# Altium schematic sheet 04 Glove Sensors.SchDoc
size 355 x 304 mm
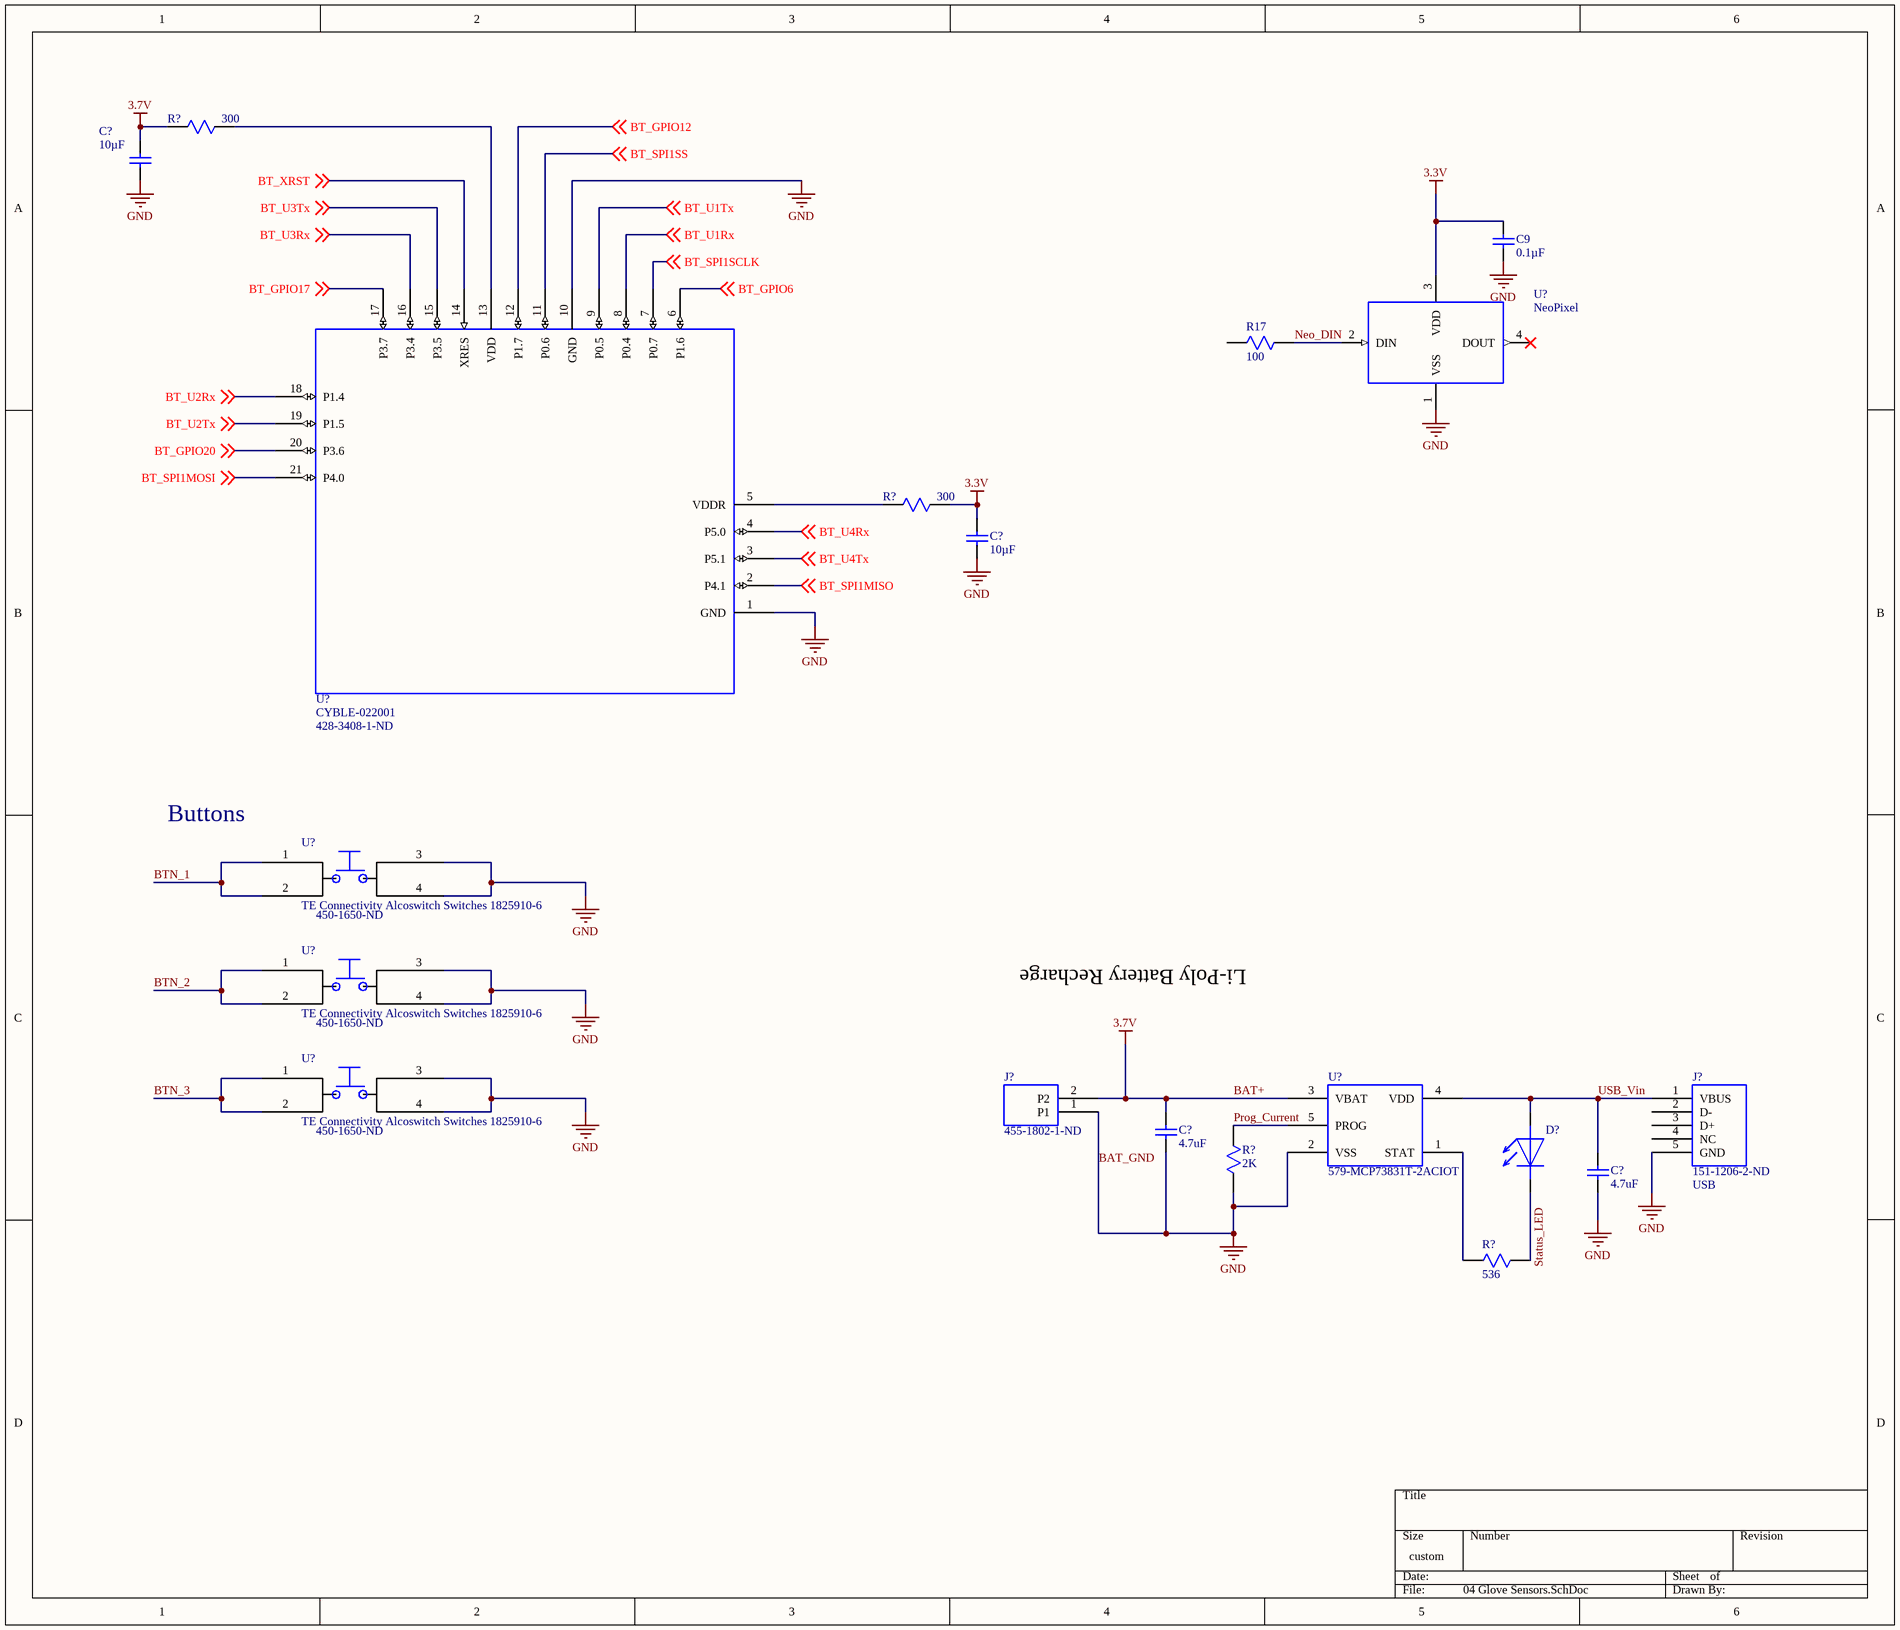
[diagram p0: 04 Glove Sensors.SchDoc]

## Parts
(Parts that share a designator on the sheet are numbered #1, #2 ... from top to bottom, then left to right.)
C9  value 0.1µF  [CAP_0805]  (hidden comment: CAP_0805_U_000_10)
C?#1  value 10µF  [CAP_0805]  (hidden comment: CAP_0805_U_010_00)
C?#2  value 10µF  [CAP_0805]  (hidden comment: CAP_0805_U_010_00)
C?#3  value 4.7uF  (hidden comment: CAP_4.7_uF)
C?#4  value 4.7uF  (hidden comment: CAP_4.7_uF)
D?  LNJ115W88RA  (value not drawn)
J?#1  Supplier Part Number 1: 455-1802-1-ND  (hidden comment: 455-1802-2-ND)
J?#2  value USB  (hidden comment: 151-1206-2-ND)
R17  value 100  [RES_0805]  (hidden comment: RES_0805_R_100_00)
R?#1  value 300  (hidden comment: RC0402JR-07300RL)
R?#2  value 300  (hidden comment: RC0402JR-07300RL)
R?#3  value 2K  (hidden comment: RMCF2010JT2K00)
R?#4  value 536  (hidden comment: ERJ-12SF5360U)
U?#1  NeoPixel  [WS2812B]
U?#2  TE Connectivity Alcoswitch Switches 1825910-6  Supplier Part Number 1: 450-1650-ND
U?#3  value CYBLE-022001  Supplier Part Number 1: 428-3408-1-ND  (hidden comment: CYBLE-022001-00)
U?#4  TE Connectivity Alcoswitch Switches 1825910-6  Supplier Part Number 1: 450-1650-ND
U?#5  TE Connectivity Alcoswitch Switches 1825910-6  Supplier Part Number 1: 450-1650-ND
U?#6  Supplier Part Number 1: 579-MCP73831T-2ACIOT  (hidden comment: MCP73831)

## Nets
3.3V: C9.2 C?#2.2 R?#2.2 U?#1.3(VDD)
BAT+: C?#1.2 C?#3.2 J?#1.2(P2) R?#1.1 U?#6.3(VBAT)  [also labelled 3.7V]
BAT_GND: C9.1 C?#1.1 C?#2.1 C?#3.1 C?#4.1 J?#1.1(P1) J?#2.5(GND) R?#3.2 U?#1.1(VSS) U?#2.3 U?#2.4 U?#3.1(GND) U?#3.10(GND) U?#4.3 U?#4.4 U?#5.3 U?#5.4 U?#6.2(VSS)  [also labelled GND]
BT_GPIO6: U?#3.6(P1.6) ; off-sheet BT_GPIO6
BT_GPIO12: U?#3.12(P1.7) ; off-sheet BT_GPIO12
BT_GPIO17: U?#3.17(P3.7) ; off-sheet BT_GPIO17
BT_GPIO20: U?#3.20(P3.6) ; off-sheet BT_GPIO20
BT_SPI1MISO: U?#3.2(P4.1) ; off-sheet BT_SPI1MISO
BT_SPI1MOSI: U?#3.21(P4.0) ; off-sheet BT_SPI1MOSI
BT_SPI1SCLK: U?#3.7(P0.7) ; off-sheet BT_SPI1SCLK
BT_SPI1SS: U?#3.11(P0.6) ; off-sheet BT_SPI1SS
BT_U1Rx: U?#3.8(P0.4) ; off-sheet BT_U1Rx
BT_U1Tx: U?#3.9(P0.5) ; off-sheet BT_U1Tx
BT_U2Rx: U?#3.18(P1.4) ; off-sheet BT_U2Rx
BT_U2Tx: U?#3.19(P1.5) ; off-sheet BT_U2Tx
BT_U3Rx: U?#3.16(P3.4) ; off-sheet BT_U3Rx
BT_U3Tx: U?#3.15(P3.5) ; off-sheet BT_U3Tx
BT_U4Rx: U?#3.4(P5.0) ; off-sheet BT_U4Rx
BT_U4Tx: U?#3.3(P5.1) ; off-sheet BT_U4Tx
BT_XRST: U?#3.14(XRES) ; off-sheet BT_XRST
BTN_1: U?#2.1 U?#2.2
BTN_2: U?#4.1 U?#4.2
BTN_3: U?#5.1 U?#5.2
Neo_DIN: R17.2 U?#1.2(DIN)
Prog_Current: R?#3.1 U?#6.5(PROG)
Status_LED: D?.?2 R?#4.2
USB_Vin: C?#4.2 D?.?1 J?#2.1(VBUS) U?#6.4(VDD)
NetR?#1_2: R?#1.2 U?#3.13(VDD)
NetR?#2_1: R?#2.1 U?#3.5(VDDR)
NetR?#4_1: R?#4.1 U?#6.1(STAT)

Not connected (* = marked no-connect by the designer): J?#2 2(D-) 3(D+) 4(NC); R17 1; U?#1 4(DOUT)*

## Notes on the sheet
- Buttons
- Li-Poly Battery Recharge

## Library data of the parts
C9 = CAP_0805_U_000_10: CAP CER 0.1UF 50V Y5V 0805; Manufacturer: Yageo; Manufacturer Part Number: CC0805ZRY5V9BB104; Tolerance: -20%, +80%; Temperature Coefficient: Y5V (F); Supplier 1: Digi-Key; Supplier Part Number 1: 311-1361-1-ND; RoHS: RoHS Compliant; Category: Capacitors; Stock 1: 86324; Pricing 1: 1=0.1, 10=0.031, 25=0.022, 100=0.0144, 250=0.01176, 500=0.01004, 1000=0.00783 (USD); Packaging: Cut Tape (CT); Voltage - Rated: 50V; Mounting Type: Surface Mount, MLCC; Operating Temperature: -30°C ~ 85°C; Applications: General Purpose; Ratings: -; Package / Case: 0805 (2012 Metric); Size / Dimension: 0.079" L x 0.049" W (2.00mm x 1.25mm); Height - Seated (Max): -; Thickness (Max): 0.024" (0.60mm); Lead Spacing: -; Features: -; Lead Style: -; ComponentLink1URL: http://www.yageo.com/documents/recent/UPY-GPHC_Y5V_6.3V-to-50V_5_revised.pdf; ComponentLink1Description: http://www.yageo.com/documents/recent/UPY-GPHC_Y5V_6.3V-to-50V_5_revised.pdf
C?#1 C?#2 = CAP_0805_U_010_00: CAP CER 10UF 10V X5R 0805; Manufacturer: Samsung Electro-Mechanics America, Inc.; Manufacturer Part Number: CL21A106KPCLQNC; Tolerance: ±10%; Supplier 1: Digi-Key; Supplier Part Number 1: 1276-2402-1-ND; RoHS: RoHS Compliant; Category: Capacitors; Stock 1: 97192; Pricing 1: 1=0.2, 10=0.14, 25=0.1052, 50=0.0806, 100=0.0665, 500=0.0469, 1000=0.0385 (USD); Packaging: Cut Tape (CT); Voltage - Rated: 10V; Temperature Coefficient: X5R; Mounting Type: Surface Mount, MLCC; Operating Temperature: -55°C ~ 85°C; Applications: General Purpose; Ratings: -; Package / Case: 0805 (2012 Metric); Size / Dimension: 0.079" L x 0.049" W (2.00mm x 1.25mm); Height - Seated (Max): -; Thickness (Max): 0.037" (0.95mm); Lead Spacing: -; Features: -; Lead Style: -; ComponentLink1URL: http://media.digikey.com/pdf/Data%20Sheets/Samsung%20PDFs/CL21A106KPCLQNC_character.pdf; ComponentLink1Description: http://media.digikey.com/pdf/Data%20Sheets/Samsung%20PDFs/CL21A106KPCLQNC_character.pdf
C?#3 C?#4 = CAP_4.7_uF: CAP_4.7uF; Manufacturer: Kemet; Manufacturer Part Number: C1206C475K4PACTU; Capacitance: 4.7µF; Tolerance: ±10%; Voltage - Rated: 16V; Temperature Coefficient: X5R; Supplier 1: Digi-Key; RoHS: RoHS Compliant; Category: Capacitors; Stock 1: 42893; Pricing 1: 1=0.3, 10=0.205, 50=0.124, 100=0.1042, 250=0.08432, 500=0.0744, 1000=0.06324 (USD); Packaging: Cut Tape (CT); Mounting Type: Surface Mount, MLCC; Operating Temperature: -55°C ~ 85°C; Applications: General Purpose; Ratings: -; Package / Case: 1206 (3216 Metric); Size / Dimension: 0.126" L x 0.063" W (3.20mm x 1.60mm); Height - Seated (Max): -; Thickness (Max): 0.071" (1.80mm); Lead Spacing: -; Features: -; Lead Style: -; ComponentLink1URL: http://www.kemet.com/docfinder?Partnumber=C1206C475K4PACTU; ComponentLink1Description: http://www.kemet.com/docfinder?Partnumber=C1206C475K4PACTU; Supplier Part Number 1: 399-1265-1-ND
D? = LNJ115W88RA: Charger Indicator LED; Manufacturer: Panasonic; Illumination Color: Amber, Green; LED Size: 1.6 mm x 1.25 mm x 0.55 mm; Product Status: Obsolete; Supplier 1: Mouser; Manufacturer Part Number: LNJ115W88RA; RoHS: RoHS Compliant; Category: Standard LEDs - SMD; Stock 1: 0; Package / Case: 0605; Packaging: Reel; Series: LN; Brand: Panasonic; Mounting Style: SMD/SMT; Standard Pack Qty: 5000; RoHS - Mouser: Y; Minimum Order Quantity: 1; Reeling: True; ComponentLink1URL: http://industrial.panasonic.com/www-cgi/jvcr13pz.cgi?E+SC+4+ATA7006+LNJ115W88RA+8+WW; ComponentLink1Description: http://industrial.panasonic.com/www-cgi/jvcr13pz.cgi?E+SC+4+ATA7006+LNJ115W88RA+8+WW; Supplier Part Number 1: 667-LNJ115W88RA
J?#1 = 455-1802-2-ND: JST connector for LiPoly battery; Manufacturer: JST Sales America Inc.; Manufacturer Part Number: SM02B-SRSS-TB(LF)(SN); Connector Type: Header, Shrouded; Number of Positions: 2; Number of Positions Loaded: All; Pitch: 0.039" (1.00mm); Supplier 1: Digi-Key; RoHS: RoHS Compliant; Category: Connectors, Interconnects; Stock 1: 94260; Pricing 1: 1=0.51, 10=0.485, 25=0.4156, 50=0.3532, 100=0.3393, 250=0.30468, 500=0.29084, 1000=0.24237 (USD); Packaging: Cut Tape (CT); Contact Type: Male Pin; Number of Rows: 1; Row Spacing: -; Contact Mating Length: -; Mounting Type: Surface Mount, Right Angle; Termination: Solder; Fastening Type: -; Features: Solder Retention; Contact Finish: Tin; Contact Finish Thickness: -; Color: Natural; ComponentLink1URL: http://www.jst-mfg.com/product/pdf/eng/eSH.pdf; ComponentLink1Description: http://www.jst-mfg.com/product/pdf/eng/eSH.pdf
J?#2 = 151-1206-2-ND: Mini USB B port; Manufacturer: EDAC Inc.; Manufacturer Part Number: 690-005-299-043; Connector Type: USB - mini B; Number of Contacts: 5; Gender: Receptacle; Supplier 1: Digi-Key; RoHS: RoHS Compliant; Category: Connectors, Interconnects; Stock 1: 28500; Pricing 1: 750=0.185, 1500=0.166, 3750=0.16, 5250=0.15, 18750=0.135, 37500=0.133, 75000=0.13 (USD); Packaging: Tape & Reel (TR); Specifications: -; Mounting Type: Surface Mount, Right Angle, Horizontal; Features: Board Guide, Solder Retention; Ingress Protection: -; ComponentLink1URL: http://media.digikey.com/pdf/Data%20Sheets/EDAC%20PDFs/690-005-299-043_Dwg.pdf; ComponentLink1Description: http://media.digikey.com/pdf/Data%20Sheets/EDAC%20PDFs/690-005-299-043_Dwg.pdf; Supplier Part Number 1: 151-1206-2-ND
R17 = RES_0805_R_100_00: RES SMD 100 OHM 1% 1/8W 0805; Manufacturer: Yageo; Manufacturer Part Number: RC0805FR-07100RL; Power (Watts): 0.125W, 1/8W; Temperature Coefficient: ±100ppm/°C; Supplier 1: Digi-Key; Supplier Part Number 1: 311-100CRCT-ND; RoHS: RoHS Compliant; Category: Resistors; Stock 1: 1160362; Pricing 1: 1=0.1, 10=0.021, 25=0.0152, 100=0.0084, 250=0.00644, 500=0.00514, 1000=0.00379, 2500=0.00329 (USD); Packaging: Cut Tape (CT); Tolerance: ±1%; Composition: Thick Film; Features: Moisture Resistant; Operating Temperature: -55°C ~ 155°C; Package / Case: 0805 (2012 Metric); Supplier Device Package: 0805; Size / Dimension: 0.079" L x 0.049" W (2.00mm x 1.25mm); Height: 0.024" (0.60mm); Number of Terminations: 2; ComponentLink1URL: http://www.yageo.com/NewPortal/yageodocoutput?fileName=/pdf/R-Chip/PYu-RC_Group_51_RoHS_L_3.pdf; ComponentLink1Description: http://www.yageo.com/NewPortal/yageodocoutput?fileName=/pdf/R-Chip/PYu-RC_Group_51_RoHS_L_3.pdf
R?#1 R?#2 = RC0402JR-07300RL: RES SMD 300 OHM 5%; Manufacturer: Yageo; Power (Watts): 0.063W, 1/16W; Temperature Coefficient: ±100ppm/°C; Supplier 1: Digi-Key; Manufacturer Part Number: RC0402JR-07300RL; RoHS: RoHS Compliant; Category: Resistors; Stock 1: 32725; Pricing 1: 1=0.1, 10=0.012, 25=0.0084, 100=0.0047, 250=0.0036, 500=0.0029, 1000=0.00213, 2500=0.00185, 5000=0.00153 (USD); Packaging: Cut Tape (CT); Resistance (Ohms): 300; Tolerance: ±5%; Composition: Thick Film; Features: Moisture Resistant; Operating Temperature: -55°C ~ 155°C; Package / Case: 0402 (1005 Metric); Supplier Device Package: 0402; Size / Dimension: 0.039" L x 0.020" W (1.00mm x 0.50mm); Height: 0.016" (0.40mm); Number of Terminations: 2; ComponentLink1URL: http://www.yageo.com/NewPortal/yageodocoutput?fileName=/pdf/R-Chip/PYu-RC_Group_51_RoHS_L_3.pdf; ComponentLink1Description: http://www.yageo.com/NewPortal/yageodocoutput?fileName=/pdf/R-Chip/PYu-RC_Group_51_RoHS_L_3.pdf; Supplier Part Number 1: 311-300JRCT-ND
R?#3 = RMCF2010JT2K00: 2KOhm; Manufacturer: Stackpole Electronics Inc.; Tolerance: ±5%; Power (Watts): 0.75W, 3/4W; Temperature Coefficient: ±200ppm/°C; Supplier 1: Digi-Key; Manufacturer Part Number: RMCF2010JT2K00; RoHS: RoHS Compliant; Category: Resistors; Stock 1: 48064; Pricing 1: 1=0.21, 10=0.182, 50=0.0958, 100=0.071, 250=0.05444, 500=0.0429, 1000=0.0297 (USD); Packaging: Cut Tape (CT); Resistance (Ohms): 2k; Composition: Thick Film; Features: Automotive AEC-Q200; Operating Temperature: -55°C ~ 155°C; Package / Case: 2010 (5025 Metric); Supplier Device Package: 2010; Size / Dimension: 0.197" L x 0.098" W (5.00mm x 2.50mm); Height: 0.028" (0.70mm); Number of Terminations: 2; ComponentLink1URL: http://www.seielect.com/Catalog/SEI-RMCF_RMCP.pdf; ComponentLink1Description: http://www.seielect.com/Catalog/SEI-RMCF_RMCP.pdf; Supplier Part Number 1: RMCF2010JT2K00CT-ND
R?#4 = ERJ-12SF5360U: 536 Ohm Resistor; Manufacturer: Panasonic Electronic Components; Tolerance: ±1%; Power (Watts): 0.75W, 3/4W; Temperature Coefficient: ±100ppm/°C; Supplier 1: Digi-Key; Manufacturer Part Number: ERJ-12SF5360U; RoHS: RoHS Compliant; Category: Resistors; Stock 1: 7146; Pricing 1: 1=0.4, 50=0.1786, 100=0.1324, 250=0.10164, 500=0.08008, 1000=0.05544 (USD); Packaging: Cut Tape (CT); Resistance (Ohms): 536; Composition: Thick Film; Features: Automotive AEC-Q200; Operating Temperature: -55°C ~ 155°C; Package / Case: 2010 (5025 Metric); Supplier Device Package: 2010; Size / Dimension: 0.197" L x 0.098" W (5.00mm x 2.50mm); Height: 0.028" (0.70mm); Number of Terminations: 2; ComponentLink1URL: http://industrial.panasonic.com/www-cgi/jvcr13pz.cgi?E+PZ+3+AOA0002+ERJ12SF5360U+7+WW; ComponentLink1Description: http://industrial.panasonic.com/www-cgi/jvcr13pz.cgi?E+PZ+3+AOA0002+ERJ12SF5360U+7+WW; Supplier Part Number 1: P536ACCT-ND
U?#1 = WS2812B-MA: LED RGB WS2812B; Manufacturer: Adafruit Industries LLC; Manufacturer Part Number: 1655; Supplier 1: Digi-Key; Supplier Part Number 1: 1528-1104-ND; RoHS: RoHS Compliant; Category: Optoelectronics; Stock 1: 672; Pricing 1: 1=4.5, 10=4.05 (USD); ComponentLink1URL: http://www.adafruit.com/datasheets/WS2812B.pdf; ComponentLink1Description: http://www.adafruit.com/datasheets/WS2812B.pdf
U?#2 U?#4 U?#5 = TE Connectivity Alcoswitch Switches 1825910-6: Push buttons to handle playback; Circuit: SPST-NO; Switch Function: Off-Mom; Contact Rating @ Voltage: 0.05A @ 24VDC; Actuator Type: Standard; Actuator Height off PCB, from Pins: 5.00mm; Actuator Orientation: Top Actuated; Outline: 6.00mm x 6.00mm; Illumination: Non-Illuminated; Operating Force: 160gf; Actuator Material: Polybutylene Terephthalate (PBT); Switch Travel: 0.25mm; Mechanical Life: 100,000 Cycles; Supplier 1: Digi-Key; Manufacturer: TE Connectivity Alcoswitch Switches; Manufacturer Part Number: 1825910-6; RoHS: RoHS Compliant; Category: Switches; Stock 1: 50462; Pricing 1: 1=0.11, 25=0.1012, 50=0.0912, 100=0.0869, 250=0.08028, 500=0.07698, 1000=0.06268, 2000=0.05609, 5000=0.05278 (USD); Packaging: Bulk; Mounting Type: Through Hole; Termination Style: PC Pin; Illumination Voltage (Nominal): -; Illumination Type, Color: -; Ingress Protection: -; Features: -; Operating Temperature: -35°C ~ 85°C; ComponentLink1URL: http://www.te.com/commerce/DocumentDelivery/DDEController?Action=srchrtrv&DocNm=1825910&DocType=Customer+Drawing&DocLang=English; ComponentLink1Description: http://www.te.com/commerce/DocumentDelivery/DDEController?Action=srchrtrv&DocNm=1825910&DocType=Customer+Drawing&DocLang=English; Value: TE Connectivity Alcoswitch Switches 1825910-6
U?#3 = CYBLE-022001-00: EZ-BLE PRoC Module; Manufacturer: Cypress Semiconductor Corp; RF Family/Standard: Bluetooth; Protocol: Bluetooth v4.1 Low Energy (BLE); Frequency: 2.4GHz; Data Rate: 1Mbps; Power - Output: 3dBm; Sensitivity: -91dBm; Serial Interfaces: I²C, SPI, UART; Antenna Type: Integrated, Chip; Memory Size: 128kB Flash, 16kB SRAM; Voltage - Supply: 1.8 V ~ 4.5 V; Current - Receiving: 16.4mA; Current - Transmitting: 15.6mA; Supplier 1: Digi-Key; Manufacturer Part Number: CYBLE-022001-00; RoHS: RoHS Compliant; Category: RF/IF and RFID; Stock 1: 1211; Pricing 1: 1=11.9, 25=10.0084, 100=9.4675, 250=8.656 (USD); Packaging: Cut Tape (CT); Modulation: -; Mounting Type: Surface Mount; Operating Temperature: -40°C ~ 85°C; Package / Case: Module; ComponentLink1URL: http://www.cypress.com/file/140791/download; ComponentLink1Description: http://www.cypress.com/file/140791/download
U?#6 = MCP73831: Li-Polymer Charge Management Controller; Manufacturer: Microchip Technology; Manufacturer Part Number: MCP73831T-2ACI/OT; Output Current: 15 mA to 500 mA; Output Voltage: 4.2 V; Battery Type: Li-Ion, Li-Polymer; Operating Supply Voltage: 3.75 V to 6 V; Supplier 1: Mouser; RoHS: RoHS Compliant; Category: Battery Management; Stock 1: 22271; Pricing 1: 1=0.600, 10=0.560, 25=0.470, 100=0.420, 3000=0.420 (USD); Package / Case: SOT-23; Packaging: Reel; Series: MCP73831/2; Brand: Microchip Technology; Mounting Style: SMD/SMT; Maximum Operating Temperature: + 85 C; Minimum Operating Temperature: - 40 C; Product Category: Battery Management; Standard Pack Qty: 3000; RoHS - Mouser: Y; Minimum Order Quantity: 1; Reeling: True; ComponentLink1URL: http://www.mouser.com/ds/2/268/20001984g-846362.pdf; ComponentLink1Description: http://www.mouser.com/ds/2/268/20001984g-846362.pdf